# EAGLE schematic monopoly (EAGLE 9.2.2)
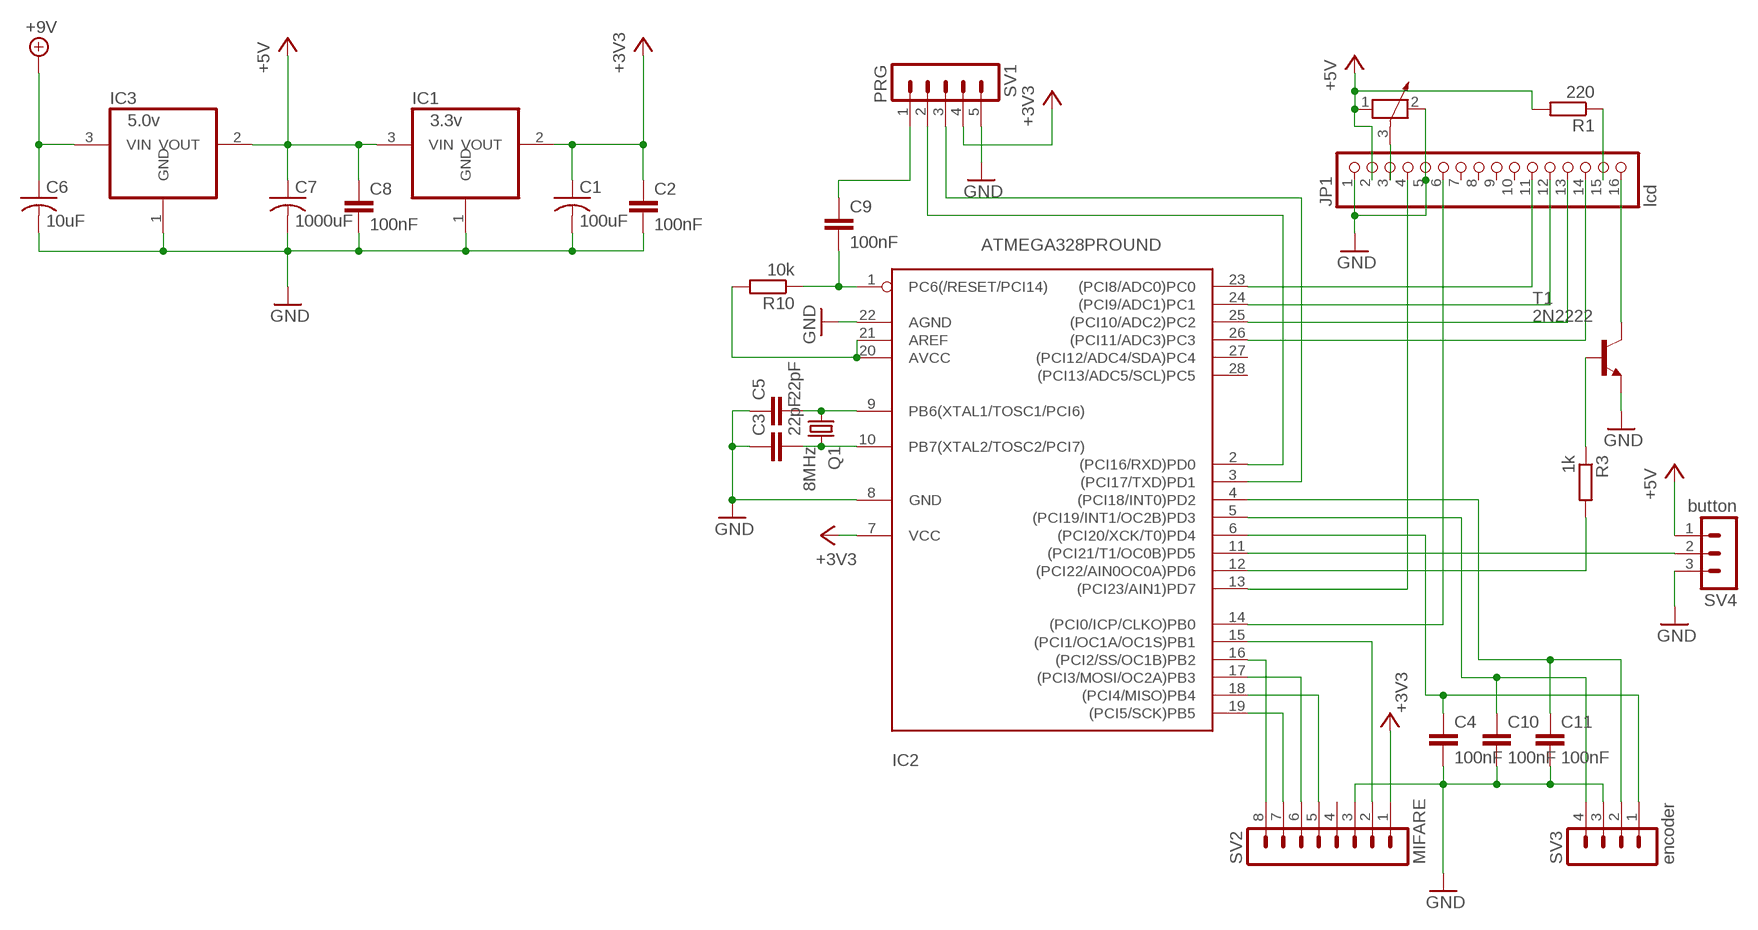
[diagram p0: schematic, sheet 1]

## Parts
C1  100uF  C-US025-024X044  [C025-024X044]
C2  100nF  C2,5-3  [C2.5-3]
C3  22pF  C2,5-3  [C2.5-3]
C4  100nF  C2,5-3  [C2.5-3]
C5  22pF  C2,5-3  [C2.5-3]
C6  10uF  C-US025-024X044  [C025-024X044]
C7  1000uF  C-US025-024X044  [C025-024X044]
C8  100nF  C2,5-3  [C2.5-3]
C9  100nF  C2,5-3  [C2.5-3]
C10  100nF  C2,5-3  [C2.5-3]
C11  100nF  C2,5-3  [C2.5-3]
IC1  3.3v  REG1117  [SOT223]
IC2  ATMEGA328PROUND  [DIL28-3-ROUND]
IC3  5.0v  REG1117  [SOT223]
JP1  lcd  PINHD-1X16  [1X16]
Q1  8MHz  CRYSTALHC18U-V  [HC18U-V]
R1  220  R0204/7  [0204/7]
R2  POTENTIOMETER_PT_SPIN  [PT-SPIN]
R3  1k  R0204/7  [0204/7]
R10  10k  R0204/7  [0204/7]
SV1  PRG  MA05-1  [MA05-1]
SV2  MIFARE  MA08-1W  [MA08-1W]
SV3  encoder  MA04-1  [MA04-1]
SV4  button  MA03-1  [MA03-1]
T1  2N2222  [TO18]

## Nets
+3V3: C1.1 C2.1 IC1.2(VOUT) IC2.7(VCC) SV1.4 SV2.1
+5V: C7.1 C8.1 IC1.3(VIN) IC3.2(VOUT) JP1.2 R1.2 R2.1 SV4.1
+9V: C6.1 IC3.3(VIN)
GND: C1.2 C2.2 C3.1 C4.2 C5.1 C6.2 C7.2 C8.2 C10.2 C11.2 IC1.1(GND) IC2.8(GND) IC2.22(AGND) IC3.1(GND) JP1.1 JP1.5 R2.2 SV1.5 SV2.3 SV3.3 SV4.3 T1.1(E)
N$1: IC2.20(AVCC) IC2.21(AREF) R10.2
N$2: IC2.13((PCI23/AIN1)PD7) JP1.4
N$3: IC2.14((PCI0/ICP/CLKO)PB0) JP1.6
N$4: JP1.3 R2.3
N$5: C9.2 IC2.1(PC6(/RESET/PCI14)) R10.1
N$6: IC2.23((PCI8/ADC0)PC0) JP1.11
N$7: C5.2 IC2.9(PB6(XTAL1/TOSC1/PCI6)) Q1.1
N$8: IC2.24((PCI9/ADC1)PC1) JP1.12
N$9: C3.2 IC2.10(PB7(XTAL2/TOSC2/PCI7)) Q1.2
N$10: C9.1 SV1.1
N$11: IC2.3((PCI17/TXD)PD1) SV1.3
N$12: IC2.2((PCI16/RXD)PD0) SV1.2
N$13: IC2.25((PCI10/ADC2)PC2) JP1.13
N$14: IC2.26((PCI11/ADC3)PC3) JP1.14
N$15: JP1.15 R1.1
N$16: IC2.12((PCI22/AIN0OC0A)PD6) R3.2
N$17: R3.1 T1.2(B)
N$18: JP1.16 T1.3(C)
N$19: IC2.15((PCI1/OC1A/OC1S)PB1) SV2.2
N$20: IC2.18((PCI4/MISO)PB4) SV2.5
N$21: IC2.17((PCI3/MOSI/OC2A)PB3) SV2.6
N$22: IC2.19((PCI5/SCK)PB5) SV2.7
N$23: IC2.16((PCI2/SS/OC1B)PB2) SV2.8
N$24: C11.1 IC2.4((PCI18/INT0)PD2) SV3.2
N$25: C10.1 IC2.5((PCI19/INT1/OC2B)PD3) SV3.4
N$26: C4.1 IC2.6((PCI20/XCK/T0)PD4) SV3.1
N$27: IC2.11((PCI21/T1/OC0B)PD5) SV4.2
Unconnected: IC2.27((PCI12/ADC4/SDA)PC4) IC2.28((PCI13/ADC5/SCL)PC5) JP1.7 JP1.8 JP1.9 JP1.10 SV2.4

## Library data of the parts
C1 C6 C7 = adafruit:C-US: CAPACITOR, American symbol
C2-C5 C8-C11 = capacitor-wima:C: CAPACITOR naming: grid - package width
IC1 IC3 = burr-brown:REG1117: 800mA and 1A Low Dropout (LDO) Positive Regulator 1.8V, 2.5V, 2.85V, 3.3V, 5V, and Adj; MPN: REG1117; OC_FARNELL: 1097566; OC_NEWARK: 14P6981
IC2 = atmega328:ATMEGA328*P: MICROCONTROLLER 32 kBytes FLASH 2 kBytes SRAM 1 kBytes EEPROM USART 8-channel 10 bit ADC
JP1 = pinhead:PINHD-1X16: PIN HEADER
Q1 = crystal:CRYSTAL: CRYSTAL; OC_FARNELL: unknown; OC_NEWARK: unknown
R1 R3 R10 = eagle-ltspice:R: RESISTOR, European symbol; SPICEMODEL: NONE; SPICEPREFIX: R
R2 = rcl:POTENTIOMETER_: Potentiometer; SPICEMODEL: POT; SPICEPREFIX: X
SV1 = con-lstb:MA05-1: PIN HEADER; OC_FARNELL: unknown; OC_NEWARK: unknown
SV2 = con-lstb:MA08-1W: PIN HEADER; OC_FARNELL: unknown; OC_NEWARK: unknown
SV3 = con-lstb:MA04-1: PIN HEADER; OC_FARNELL: unknown; OC_NEWARK: unknown
SV4 = con-lstb:MA03-1: PIN HEADER; OC_FARNELL: unknown; OC_NEWARK: unknown
T1 = transistor:2N2222: NPN TRANSISTOR